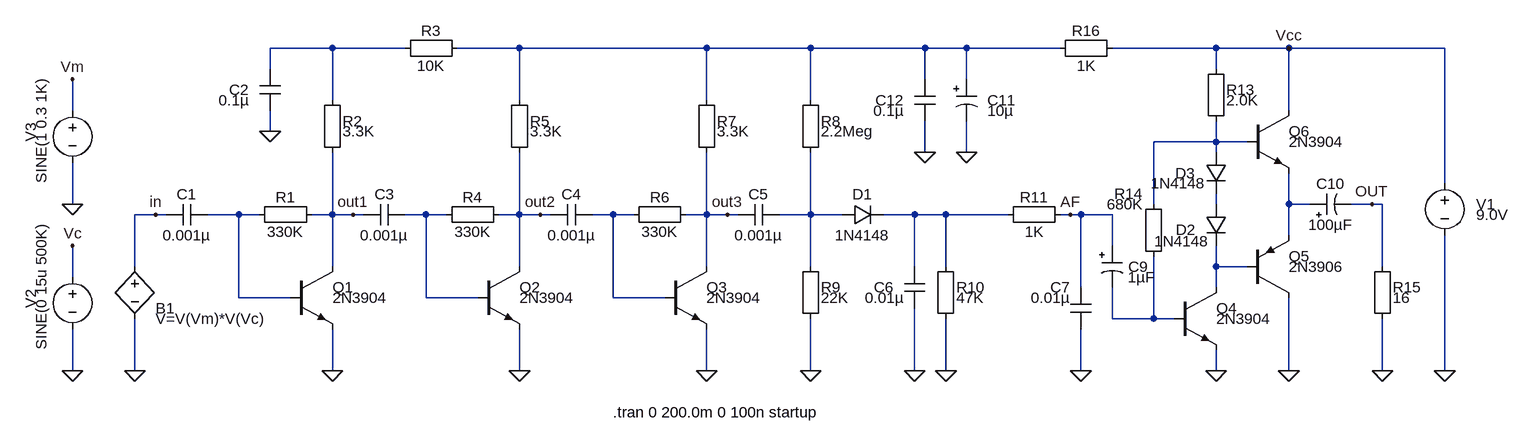
[diagram p0: schematic trf_receiver.asc]
trf_receiver.asc, the LTspice schematic file:
Version 4
SHEET 1 2412 680
WIRE -16 -1136 -112 -1136
WIRE 96 -1136 -16 -1136
WIRE 272 -1136 176 -1136
WIRE 560 -1136 272 -1136
WIRE 720 -1136 560 -1136
WIRE 896 -1136 720 -1136
WIRE 960 -1136 896 -1136
WIRE 1104 -1136 960 -1136
WIRE 1344 -1136 1184 -1136
WIRE 1456 -1136 1344 -1136
WIRE 1696 -1136 1456 -1136
WIRE -112 -1104 -112 -1136
WIRE 1344 -1104 1344 -1136
WIRE 896 -1088 896 -1136
WIRE 960 -1088 960 -1136
WIRE -16 -1056 -16 -1136
WIRE 272 -1056 272 -1136
WIRE 560 -1056 560 -1136
WIRE 720 -1056 720 -1136
WIRE -416 -1040 -416 -1088
WIRE 1456 -1040 1456 -1136
WIRE -112 -1008 -112 -1040
WIRE 1344 -992 1344 -1024
WIRE 1344 -992 1248 -992
WIRE 1392 -992 1344 -992
WIRE 896 -976 896 -1024
WIRE 960 -976 960 -1024
WIRE 1344 -976 1344 -992
WIRE 1696 -928 1696 -1136
WIRE -416 -896 -416 -960
WIRE 1248 -896 1248 -992
WIRE 1344 -896 1344 -912
WIRE 1456 -896 1456 -944
WIRE 1488 -896 1456 -896
WIRE 1584 -896 1552 -896
WIRE 1600 -896 1584 -896
WIRE -288 -880 -320 -880
WIRE -272 -880 -288 -880
WIRE -160 -880 -208 -880
WIRE -128 -880 -160 -880
WIRE -16 -880 -16 -976
WIRE -16 -880 -48 -880
WIRE 16 -880 -16 -880
WIRE 32 -880 16 -880
WIRE 128 -880 96 -880
WIRE 160 -880 128 -880
WIRE 272 -880 272 -976
WIRE 272 -880 240 -880
WIRE 304 -880 272 -880
WIRE 320 -880 304 -880
WIRE 416 -880 384 -880
WIRE 448 -880 416 -880
WIRE 560 -880 560 -976
WIRE 560 -880 528 -880
WIRE 592 -880 560 -880
WIRE 608 -880 592 -880
WIRE 720 -880 720 -976
WIRE 720 -880 672 -880
WIRE 768 -880 720 -880
WIRE 880 -880 832 -880
WIRE 928 -880 880 -880
WIRE 1024 -880 928 -880
WIRE 1120 -880 1104 -880
WIRE 1136 -880 1120 -880
WIRE 1184 -880 1136 -880
WIRE 1456 -848 1456 -896
WIRE 1184 -832 1184 -880
WIRE -320 -800 -320 -880
WIRE -16 -800 -16 -880
WIRE 272 -800 272 -880
WIRE 560 -800 560 -880
WIRE 720 -800 720 -880
WIRE 880 -800 880 -880
WIRE 928 -800 928 -880
WIRE 1344 -800 1344 -832
WIRE 1392 -800 1344 -800
WIRE 1600 -800 1600 -896
WIRE -416 -784 -416 -832
WIRE 1136 -768 1136 -880
WIRE 1344 -768 1344 -800
WIRE -160 -752 -160 -880
WIRE -80 -752 -160 -752
WIRE 128 -752 128 -880
WIRE 208 -752 128 -752
WIRE 416 -752 416 -880
WIRE 496 -752 416 -752
WIRE 1184 -720 1184 -768
WIRE 1248 -720 1248 -816
WIRE 1248 -720 1184 -720
WIRE 1280 -720 1248 -720
WIRE -416 -640 -416 -704
WIRE -320 -640 -320 -720
WIRE -16 -640 -16 -704
WIRE 272 -640 272 -704
WIRE 560 -640 560 -704
WIRE 720 -640 720 -720
WIRE 880 -640 880 -736
WIRE 928 -640 928 -720
WIRE 1136 -640 1136 -704
WIRE 1344 -640 1344 -672
WIRE 1456 -640 1456 -752
WIRE 1600 -640 1600 -720
WIRE 1696 -640 1696 -848
FLAG 1696 -640 0
FLAG -16 -640 0
FLAG -112 -1008 0
FLAG -416 -896 0
FLAG 272 -640 0
FLAG 560 -640 0
FLAG 1456 -1136 Vcc
FLAG -288 -880 in
FLAG 16 -880 out1
FLAG 304 -880 out2
FLAG 592 -880 out3
FLAG 720 -640 0
FLAG 880 -640 0
FLAG 928 -640 0
FLAG -320 -640 0
FLAG -416 -1088 Vm
FLAG -416 -640 0
FLAG -416 -832 Vc
FLAG 1136 -640 0
FLAG 1120 -880 AF
FLAG 1344 -640 0
FLAG 1456 -640 0
FLAG 1600 -640 0
FLAG 1584 -896 OUT
FLAG 960 -976 0
FLAG 896 -976 0
SYMBOL voltage 1696 -944 R0
WINDOW 0 48 48 Left 2
WINDOW 3 48 64 Left 2
WINDOW 123 0 0 Left 2
WINDOW 39 0 0 Left 2
SYMATTR InstName V1
SYMATTR Value 9.0V
SYMBOL cap -272 -864 R270
WINDOW 0 32 32 VTop 2
WINDOW 3 0 32 VBottom 2
SYMATTR InstName C1
SYMATTR Value 0.001µ
SYMATTR SpiceLine V=10 Irms=41.2m Rser=2.70485 Lser=0 mfg="KEMET" pn="C0805C102K8RAC" type="X7R"
SYMBOL Misc\\EuropeanResistor -32 -896 R90
WINDOW 0 5 56 VBottom 2
WINDOW 3 27 56 VTop 2
SYMATTR InstName R1
SYMATTR Value 330K
SYMBOL Misc\\EuropeanResistor -32 -1072 R0
WINDOW 0 32 48 Left 2
WINDOW 3 32 64 Left 2
SYMATTR InstName R2
SYMATTR Value 3.3K
SYMBOL npn -80 -800 R0
WINDOW 0 64 32 Left 2
WINDOW 3 64 48 Left 2
SYMATTR InstName Q1
SYMATTR Value 2N3904
SYMBOL Misc\\EuropeanResistor 192 -1152 R90
WINDOW 0 5 56 VBottom 2
WINDOW 3 27 56 VTop 2
SYMATTR InstName R3
SYMATTR Value 10K
SYMBOL cap -96 -1040 R180
WINDOW 0 48 32 Left 2
WINDOW 3 48 16 Left 2
SYMATTR InstName C2
SYMATTR Value 0.1µ
SYMATTR SpiceLine V=10 Irms=1.34 Rser=0.0989014 Lser=0 mfg="KEMET" pn="C0805C104K8RAC" type="X7R"
SYMBOL cap 32 -864 R270
WINDOW 0 32 32 VTop 2
WINDOW 3 0 32 VBottom 2
SYMATTR InstName C3
SYMATTR Value 0.001µ
SYMATTR SpiceLine V=10 Irms=41.2m Rser=2.70485 Lser=0 mfg="KEMET" pn="C0805C102K8RAC" type="X7R"
SYMBOL Misc\\EuropeanResistor 256 -896 R90
WINDOW 0 5 56 VBottom 2
WINDOW 3 27 56 VTop 2
SYMATTR InstName R4
SYMATTR Value 330K
SYMBOL Misc\\EuropeanResistor 256 -1072 R0
WINDOW 0 32 48 Left 2
WINDOW 3 32 64 Left 2
SYMATTR InstName R5
SYMATTR Value 3.3K
SYMBOL npn 208 -800 R0
WINDOW 0 64 32 Left 2
WINDOW 3 64 48 Left 2
SYMATTR InstName Q2
SYMATTR Value 2N3904
SYMBOL cap 320 -864 R270
WINDOW 0 32 32 VTop 2
WINDOW 3 0 32 VBottom 2
SYMATTR InstName C4
SYMATTR Value 0.001µ
SYMATTR SpiceLine V=10 Irms=41.2m Rser=2.70485 Lser=0 mfg="KEMET" pn="C0805C102K8RAC" type="X7R"
SYMBOL Misc\\EuropeanResistor 544 -896 R90
WINDOW 0 5 56 VBottom 2
WINDOW 3 27 56 VTop 2
SYMATTR InstName R6
SYMATTR Value 330K
SYMBOL Misc\\EuropeanResistor 544 -1072 R0
WINDOW 0 32 48 Left 2
WINDOW 3 32 64 Left 2
SYMATTR InstName R7
SYMATTR Value 3.3K
SYMBOL npn 496 -800 R0
WINDOW 0 64 32 Left 2
WINDOW 3 64 48 Left 2
SYMATTR InstName Q3
SYMATTR Value 2N3904
SYMBOL cap 608 -864 R270
WINDOW 0 32 32 VTop 2
WINDOW 3 0 32 VBottom 2
SYMATTR InstName C5
SYMATTR Value 0.001µ
SYMATTR SpiceLine V=10 Irms=41.2m Rser=2.70485 Lser=0 mfg="KEMET" pn="C0805C102K8RAC" type="X7R"
SYMBOL diode 768 -864 R270
WINDOW 0 32 32 VTop 2
WINDOW 3 0 32 VBottom 2
SYMATTR InstName D1
SYMATTR Value 1N4148
SYMBOL Misc\\EuropeanResistor 704 -1072 R0
WINDOW 0 32 48 Left 2
WINDOW 3 32 64 Left 2
SYMATTR InstName R8
SYMATTR Value 2.2Meg
SYMBOL Misc\\EuropeanResistor 704 -816 R0
WINDOW 0 32 48 Left 2
WINDOW 3 32 64 Left 2
SYMATTR InstName R9
SYMATTR Value 22K
SYMBOL Misc\\EuropeanResistor 912 -816 R0
WINDOW 0 32 48 Left 2
WINDOW 3 32 64 Left 2
SYMATTR InstName R10
SYMATTR Value 47K
SYMBOL cap 896 -736 R180
WINDOW 0 48 32 Left 2
WINDOW 3 32 16 Left 2
SYMATTR InstName C6
SYMATTR Value 0.01µ
SYMATTR SpiceLine V=10 Irms=272m Rser=0.391699 Lser=0 mfg="KEMET" pn="C0805C103K8RAC" type="X7R"
SYMBOL voltage -416 -1056 R0
WINDOW 0 -64 64 VLeft 2
WINDOW 3 -48 128 VLeft 2
WINDOW 123 0 0 Left 2
WINDOW 39 0 0 Left 2
SYMATTR InstName V3
SYMATTR Value SINE(1 0.3 1K)
SYMBOL voltage -416 -800 R0
WINDOW 0 -64 64 VLeft 2
WINDOW 3 -48 128 VLeft 2
WINDOW 123 0 0 Left 2
WINDOW 39 0 0 Left 2
SYMATTR InstName V2
SYMATTR Value SINE(0 15u 500K)
SYMBOL bv -320 -816 R0
WINDOW 0 32 80 Left 2
WINDOW 3 32 96 Left 2
SYMATTR InstName B1
SYMATTR Value V=V(Vm)*V(Vc)
SYMBOL Misc\\EuropeanResistor 1120 -896 R90
WINDOW 0 5 56 VBottom 2
WINDOW 3 27 56 VTop 2
SYMATTR InstName R11
SYMATTR Value 1K
SYMBOL cap 1152 -704 R180
WINDOW 0 32 64 Left 2
WINDOW 3 32 48 Left 2
SYMATTR InstName C7
SYMATTR Value 0.01µ
SYMATTR SpiceLine V=10 Irms=272m Rser=0.391699 Lser=0 mfg="KEMET" pn="C0805C103K8RAC" type="X7R"
SYMBOL npn 1280 -768 R0
WINDOW 0 64 32 Left 2
WINDOW 3 64 48 Left 2
SYMATTR InstName Q4
SYMATTR Value 2N3904
SYMBOL npn 1392 -1040 R0
WINDOW 0 64 32 Left 2
WINDOW 3 64 48 Left 2
SYMATTR InstName Q6
SYMATTR Value 2N3904
SYMBOL pnp 1392 -752 M180
WINDOW 0 64 64 Left 2
WINDOW 3 64 48 Left 2
SYMATTR InstName Q5
SYMATTR Value 2N3906
SYMBOL diode 1328 -896 R0
WINDOW 0 -15 39 Right 2
WINDOW 3 6 57 Right 2
SYMATTR InstName D2
SYMATTR Value 1N4148
SYMBOL diode 1328 -976 R0
WINDOW 0 -16 32 Right 2
WINDOW 3 0 48 Right 2
SYMATTR InstName D3
SYMATTR Value 1N4148
SYMBOL Misc\\EuropeanResistor 1328 -1120 R0
WINDOW 0 32 48 Left 2
WINDOW 3 32 64 Left 2
SYMATTR InstName R13
SYMATTR Value 2.0K
SYMBOL Misc\\EuropeanResistor 1232 -912 R0
WINDOW 0 0 0 Right 2
WINDOW 3 0 16 Right 2
SYMATTR InstName R14
SYMATTR Value 680K
SYMBOL Misc\\EuropeanPolcap 1168 -832 R0
WINDOW 0 41 32 Left 2
WINDOW 3 40 48 Left 2
SYMATTR InstName C9
SYMATTR Value 1µF
SYMBOL Misc\\EuropeanPolcap 1488 -880 R270
WINDOW 0 32 32 VTop 2
WINDOW 3 0 32 VBottom 2
SYMATTR InstName C10
SYMATTR Value 100µF
SYMBOL Misc\\EuropeanResistor 1584 -816 R0
WINDOW 0 32 48 Left 2
WINDOW 3 32 64 Left 2
SYMATTR InstName R15
SYMATTR Value 16
SYMBOL Misc\\EuropeanResistor 1200 -1152 R90
WINDOW 0 5 56 VBottom 2
WINDOW 3 27 56 VTop 2
SYMATTR InstName R16
SYMATTR Value 1K
SYMBOL Misc\\EuropeanPolcap 944 -1088 R0
WINDOW 0 48 32 Left 2
WINDOW 3 48 48 Left 2
SYMATTR InstName C11
SYMATTR Value 10µ
SYMATTR SpiceLine V=16 Irms=0 Rser=2.8 Lser=0 mfg="AVX" pn="TAJC106M016" type="Tantalum"
SYMBOL cap 912 -1024 R180
WINDOW 0 48 32 Left 2
WINDOW 3 48 16 Left 2
SYMATTR InstName C12
SYMATTR Value 0.1µ
SYMATTR SpiceLine V=10 Irms=1.34 Rser=0.0989014 Lser=0 mfg="KEMET" pn="C0805C104K8RAC" type="X7R"
TEXT 416 -576 Left 2 !.tran 0 200.0m 0 100n startup

The netlist it stands for:
* trf_receiver.asc
V1 Vcc 0 9.0V
C1 in N006 0.001µ V=10 Irms=41.2m Rser=2.70485 Lser=0 mfg="KEMET" pn="C0805C102K8RAC" type="X7R"
R1 out1 N006 330K
R2 N001 out1 3.3K
Q1 out1 N006 0 0 2N3904
R3 N002 N001 10K
C2 0 N001 0.1µ V=10 Irms=1.34 Rser=0.0989014 Lser=0 mfg="KEMET" pn="C0805C104K8RAC" type="X7R"
C3 out1 N007 0.001µ V=10 Irms=41.2m Rser=2.70485 Lser=0 mfg="KEMET" pn="C0805C102K8RAC" type="X7R"
R4 out2 N007 330K
R5 N002 out2 3.3K
Q2 out2 N007 0 0 2N3904
C4 out2 N008 0.001µ V=10 Irms=41.2m Rser=2.70485 Lser=0 mfg="KEMET" pn="C0805C102K8RAC" type="X7R"
R6 out3 N008 330K
R7 N002 out3 3.3K
Q3 out3 N008 0 0 2N3904
C5 out3 N009 0.001µ V=10 Irms=41.2m Rser=2.70485 Lser=0 mfg="KEMET" pn="C0805C102K8RAC" type="X7R"
D1 N009 N010 1N4148
R8 N002 N009 2.2Meg
R9 N009 0 22K
R10 N010 0 47K
C6 0 N010 0.01µ V=10 Irms=272m Rser=0.391699 Lser=0 mfg="KEMET" pn="C0805C103K8RAC" type="X7R"
V3 Vm 0 SINE(1 0.3 1K)
V2 Vc 0 SINE(0 15u 500K)
B1 in 0 V=V(Vm)*V(Vc)
R11 AF N010 1K
C7 0 AF 0.01µ V=10 Irms=272m Rser=0.391699 Lser=0 mfg="KEMET" pn="C0805C103K8RAC" type="X7R"
Q4 N011 N012 0 0 2N3904
Q6 Vcc N003 N005 0 2N3904
Q5 0 N011 N005 0 2N3906
D2 N004 N011 1N4148
D3 N003 N004 1N4148
R13 Vcc N003 2.0K
R14 N003 N012 680K
C9 AF N012 1µF
C10 N005 OUT 100µF
R15 OUT 0 16
R16 Vcc N002 1K
C11 N002 0 10µ V=16 Irms=0 Rser=2.8 Lser=0 mfg="AVX" pn="TAJC106M016" type="Tantalum"
C12 0 N002 0.1µ V=10 Irms=1.34 Rser=0.0989014 Lser=0 mfg="KEMET" pn="C0805C104K8RAC" type="X7R"
.model D D
.lib standard.dio
.model NPN NPN
.model PNP PNP
.lib standard.bjt
.tran 0 200.0m 0 100n startup
.backanno
.end